# EAGLE schematic Rover Interface Board (EAGLE 9.6.0)
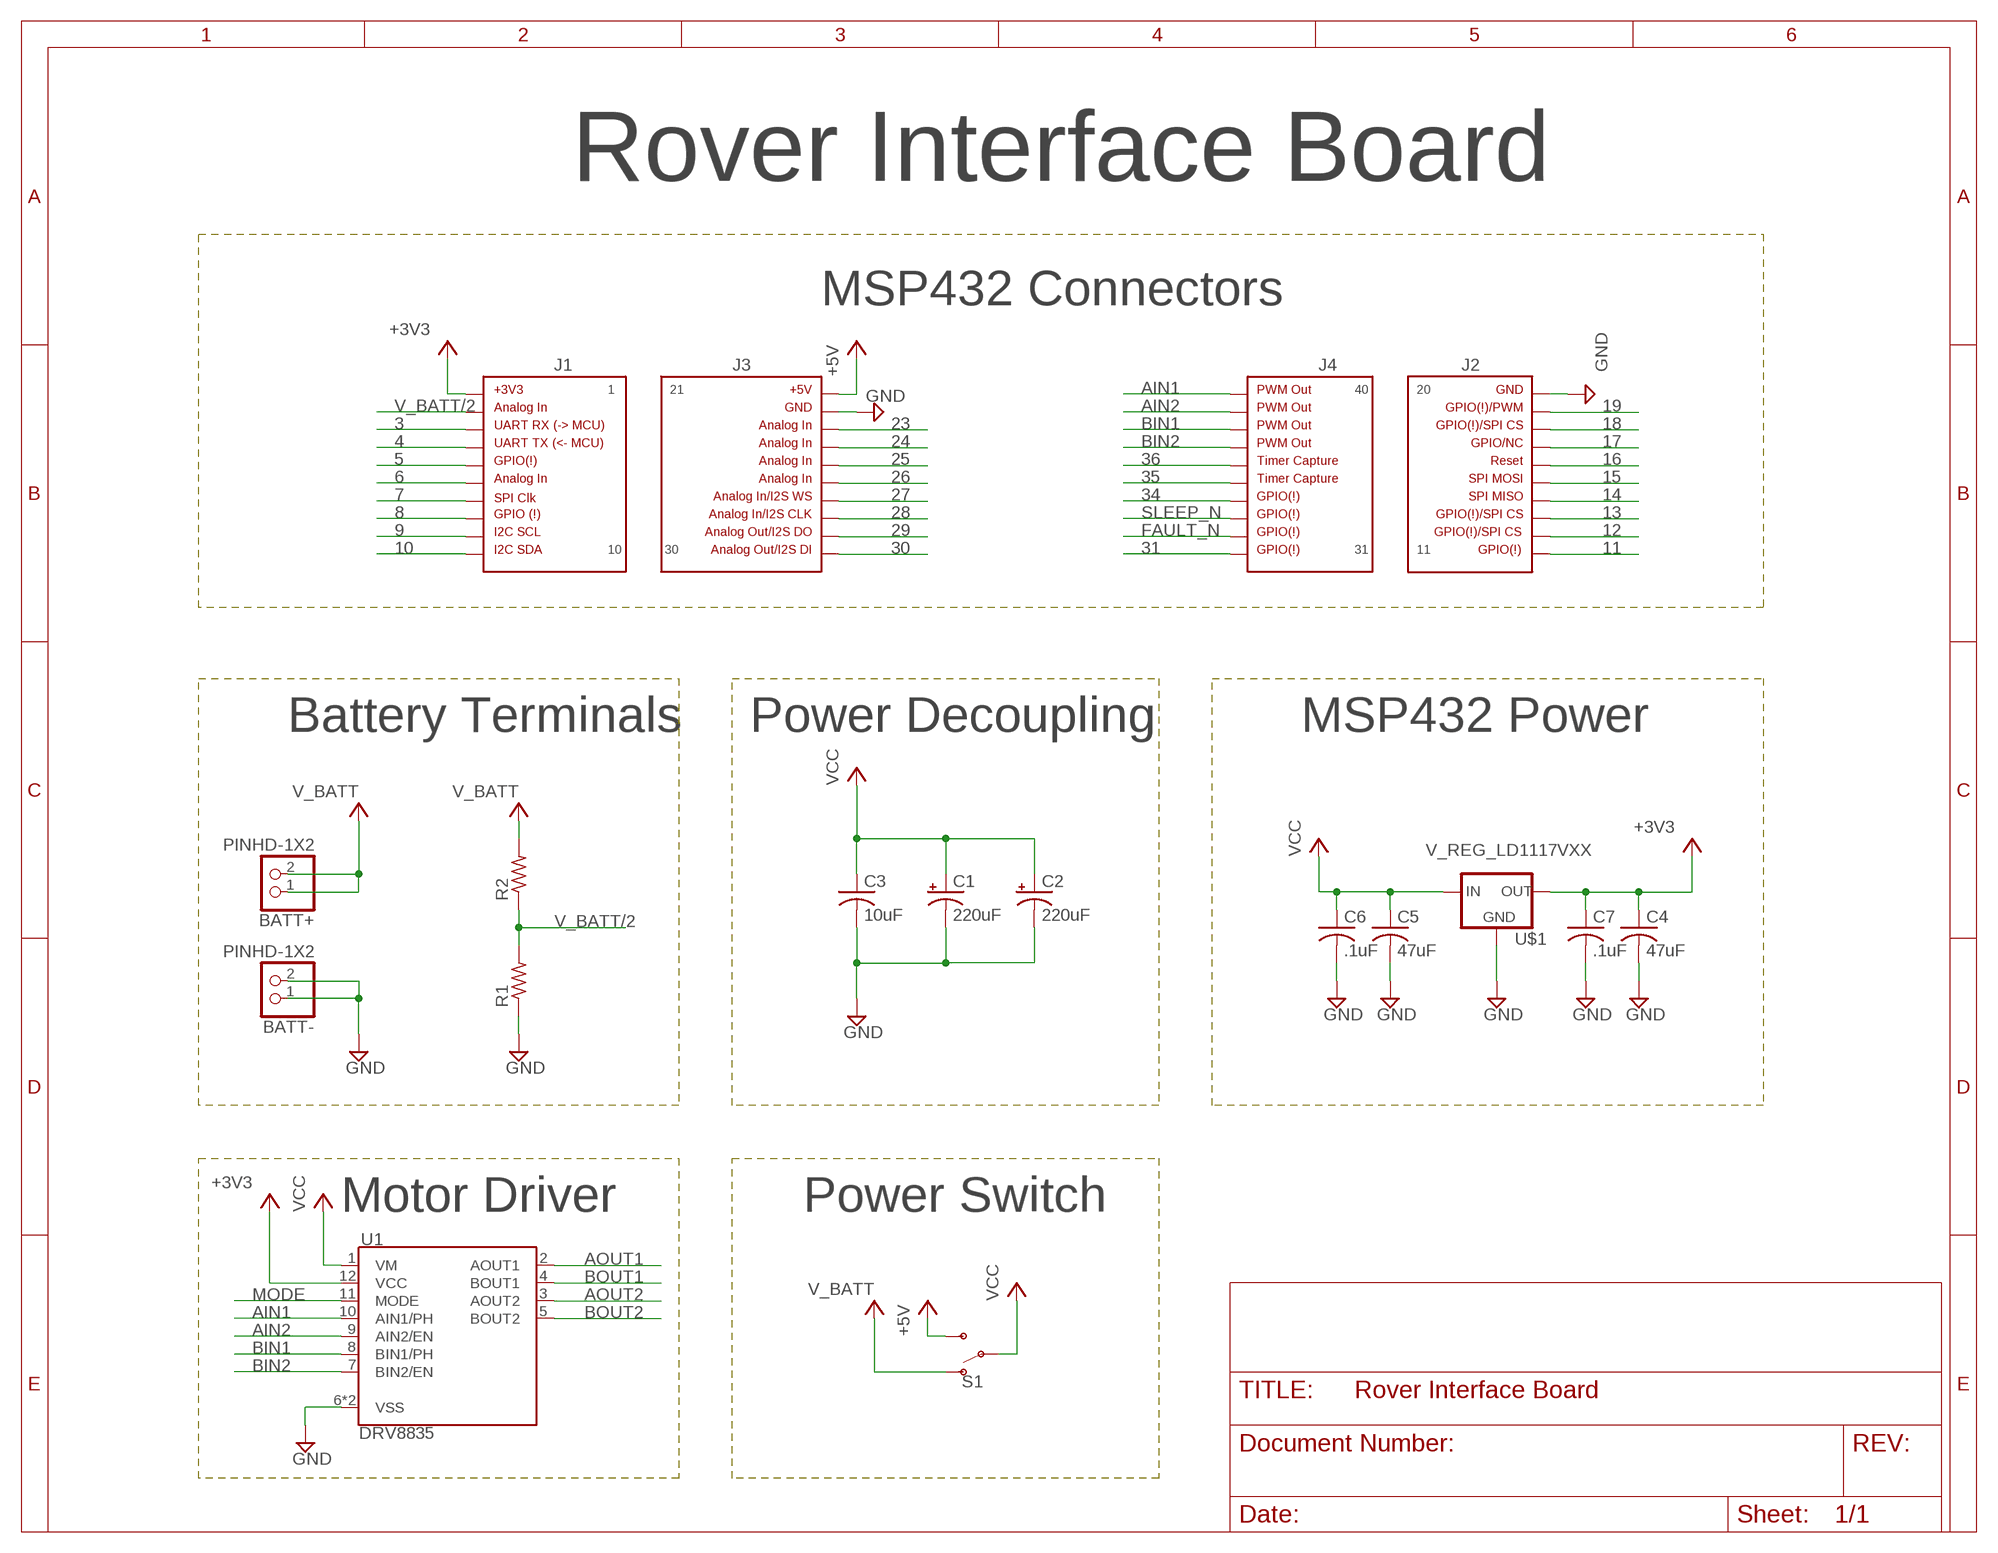
[diagram p0: schematic, sheet 1]

## Parts
BATT+  PINHD-1X2  [1X02]
BATT-  PINHD-1X2  [1X02]
C1  220uF  1000UF-RADIAL-5MM-25V-20%  [CPOL-RADIAL-5MM-10MM]
C2  220uF  1000UF-RADIAL-5MM-25V-20%  [CPOL-RADIAL-5MM-10MM]
C3  10uF  C-US025-050X050  [C025-050X050]
C4  47uF  C-US025-050X050  [C025-050X050]
C5  47uF  C-US025-050X050  [C025-050X050]
C6  .1uF  C-US025-050X050  [C025-050X050]
C7  .1uF  C-US025-050X050  [C025-050X050]
J1  HEADER1X10-J1SILK_LABELS  [J1]
J2  HEADER1X10-J2SILK_LABELS  [J2]
J3  HEADER1X10-J3  [J3]
J4  HEADER1X10-J4SILK_LABELS  [J4]
R1  R-US_0204/7  [0204/7]
R2  R-US_0204/7  [0204/7]
S1  SWITCH-SPDT-PTH-11.6X4.0MM  [SWITCH_SPDT_PTH_11.6X4.0MM]
U1  DRV8835  DRV883X  [WSON-12]
U$1  V_REG_LD1117VXX  [78XXL]

## Nets
3: J1.3
4: J1.4
5: J1.5
6: J1.6
7: J1.7
8: J1.8
9: J1.9
10: J1.10
11: J2.11
12: J2.12
13: J2.13
14: J2.14
15: J2.15
16: J2.16
17: J2.17
18: J2.18
19: J2.19
23: J3.23
24: J3.24
25: J3.25
26: J3.26
27: J3.27
28: J3.28
29: J3.29
30: J3.30
31: J4.31
34: J4.34
35: J4.35
36: J4.36
+3V3: C4.1 C7.1 J1.1 U1.12(VCC) U$1.GND(OUT)
+5V: J3.21 S1.3(S)
AIN1: J4.40 U1.10(AIN1/PH)
AIN2: J4.39 U1.9(AIN2/EN)
AOUT1: U1.2(AOUT1)
AOUT2: U1.3(AOUT2)
BIN1: J4.38 U1.8(BIN1/PH)
BIN2: J4.37 U1.7(BIN2/EN)
BOUT1: U1.4(BOUT1)
BOUT2: U1.5(BOUT2)
FAULT_N: J4.32
GND: BATT-.1 BATT-.2 C1.- C2.- C3.2 C4.2 C5.2 C6.2 C7.2 J2.20 J3.22 R1.1 U1.6(VSS) U1.PAD(VSS) U$1.IN(GND)
MODE: U1.11(MODE)
SLEEP_N: J4.33
V_BATT: BATT+.1 BATT+.2 R2.2 S1.1(O)
V_BATT/2: J1.2 R1.2 R2.1
VCC: C1.+ C2.+ C3.1 C5.1 C6.1 S1.2(P) U1.1(VM) U$1.OUT(IN)

## Notes on the sheet
- Rover Interface Board
- MSP432 Connectors
- Battery Terminals | Power Decoupling | MSP432 Power
- Motor Driver | Power Switch

## Library data of the parts
BATT+ BATT- = Connector:PINHD-1X2: PIN HEADER; CATEGORY: CONNECTOR; SUB-CATEGORY: PIN-HEADER
C1 C2 = Rover Library:1000UF: 1,000µF/1mF ceramic capacitors A capacitor is a passive two-terminal electrical component used to store electrical energy temporarily in an electric field. CAP-08070; PROD_ID: CAP-09538; VALUE: 1mF
C3-C7 = rcl:C-US: CAPACITOR, American symbol; SPICEPREFIX: C
J1 = MSP-EXP432P401R_EagleCAD:HEADER1X10-J1
J2 = MSP-EXP432P401R_EagleCAD:HEADER1X10-J2
J3 = MSP-EXP432P401R_EagleCAD:HEADER1X10-J3
J4 = MSP-EXP432P401R_EagleCAD:HEADER1X10-J4
R1 R2 = rcl:R-US_: RESISTOR, American symbol; SPICEPREFIX: R
S1 = SparkFun-Switches:SWITCH-SPDT: Single Pole, Double Throw (SPDT) Switch Single-pole, double-throw (SPDT) switch. Variant Overview SMD-AYZ0202 Surface Mount DPDT Switch <https://www.sparkfun.com/products/597> (COM-00597) Used on e.g. LilyPad Arduino USB - ATmega32U4 Board <https://www.sparkfun.com/products/12049> PTH-11.6X4.0MM SPDT Mini Power Switch <https://www.sparkfun.com/products/102> (COM-00102) Used on e.g. SparkFun Simon Says - Through-Hole Soldering Kit <https://www.sparkfun.com/products/10547> (KIT-10547) PTH-11.6X4.0MM-KIT KIT version of SPDT Mini Power Switch - Simplifies soldering by removing tStop of switch pins - only one side can be soldered. PTH-11.6X4.0MM-LOCK LOCK version of SPDT Mini Power Switch - Offset pins hold switch in place for easier soldering. SMD-RIGHT-ANGLE Surface Mount Right Angle Switch <https://www.sparkfun.com/products/10860> (COM-10860) Used on e.g. SparkFun ESP8266 Thing <https://www.sparkfun.com/products/13231>; PROD_ID: SWCH-08261; SF_SKU: COM-00102
U1 = SparkFun-IC-Special-Function:DRV883X: DRV8835 2 Channel Motor Driver Dual 1.5A H-bridge, 2-11V Datasheet <http://www.ti.com/lit/ds/symlink/drv8835.pdf> SparkFun Products: SparkFun Serial Controlled Motor Driver <https://www.sparkfun.com/products/13911>; PROD_ID: IC-13342
U$1 = SparkFun-IC-Power:V_REG_LD1117VXX: LD1117VXX voltage regulator. We carry the 3.3V version (COM-00526) in TO-220 package.